# EAGLE schematic basic-maschinen (EAGLE 6.6.0)
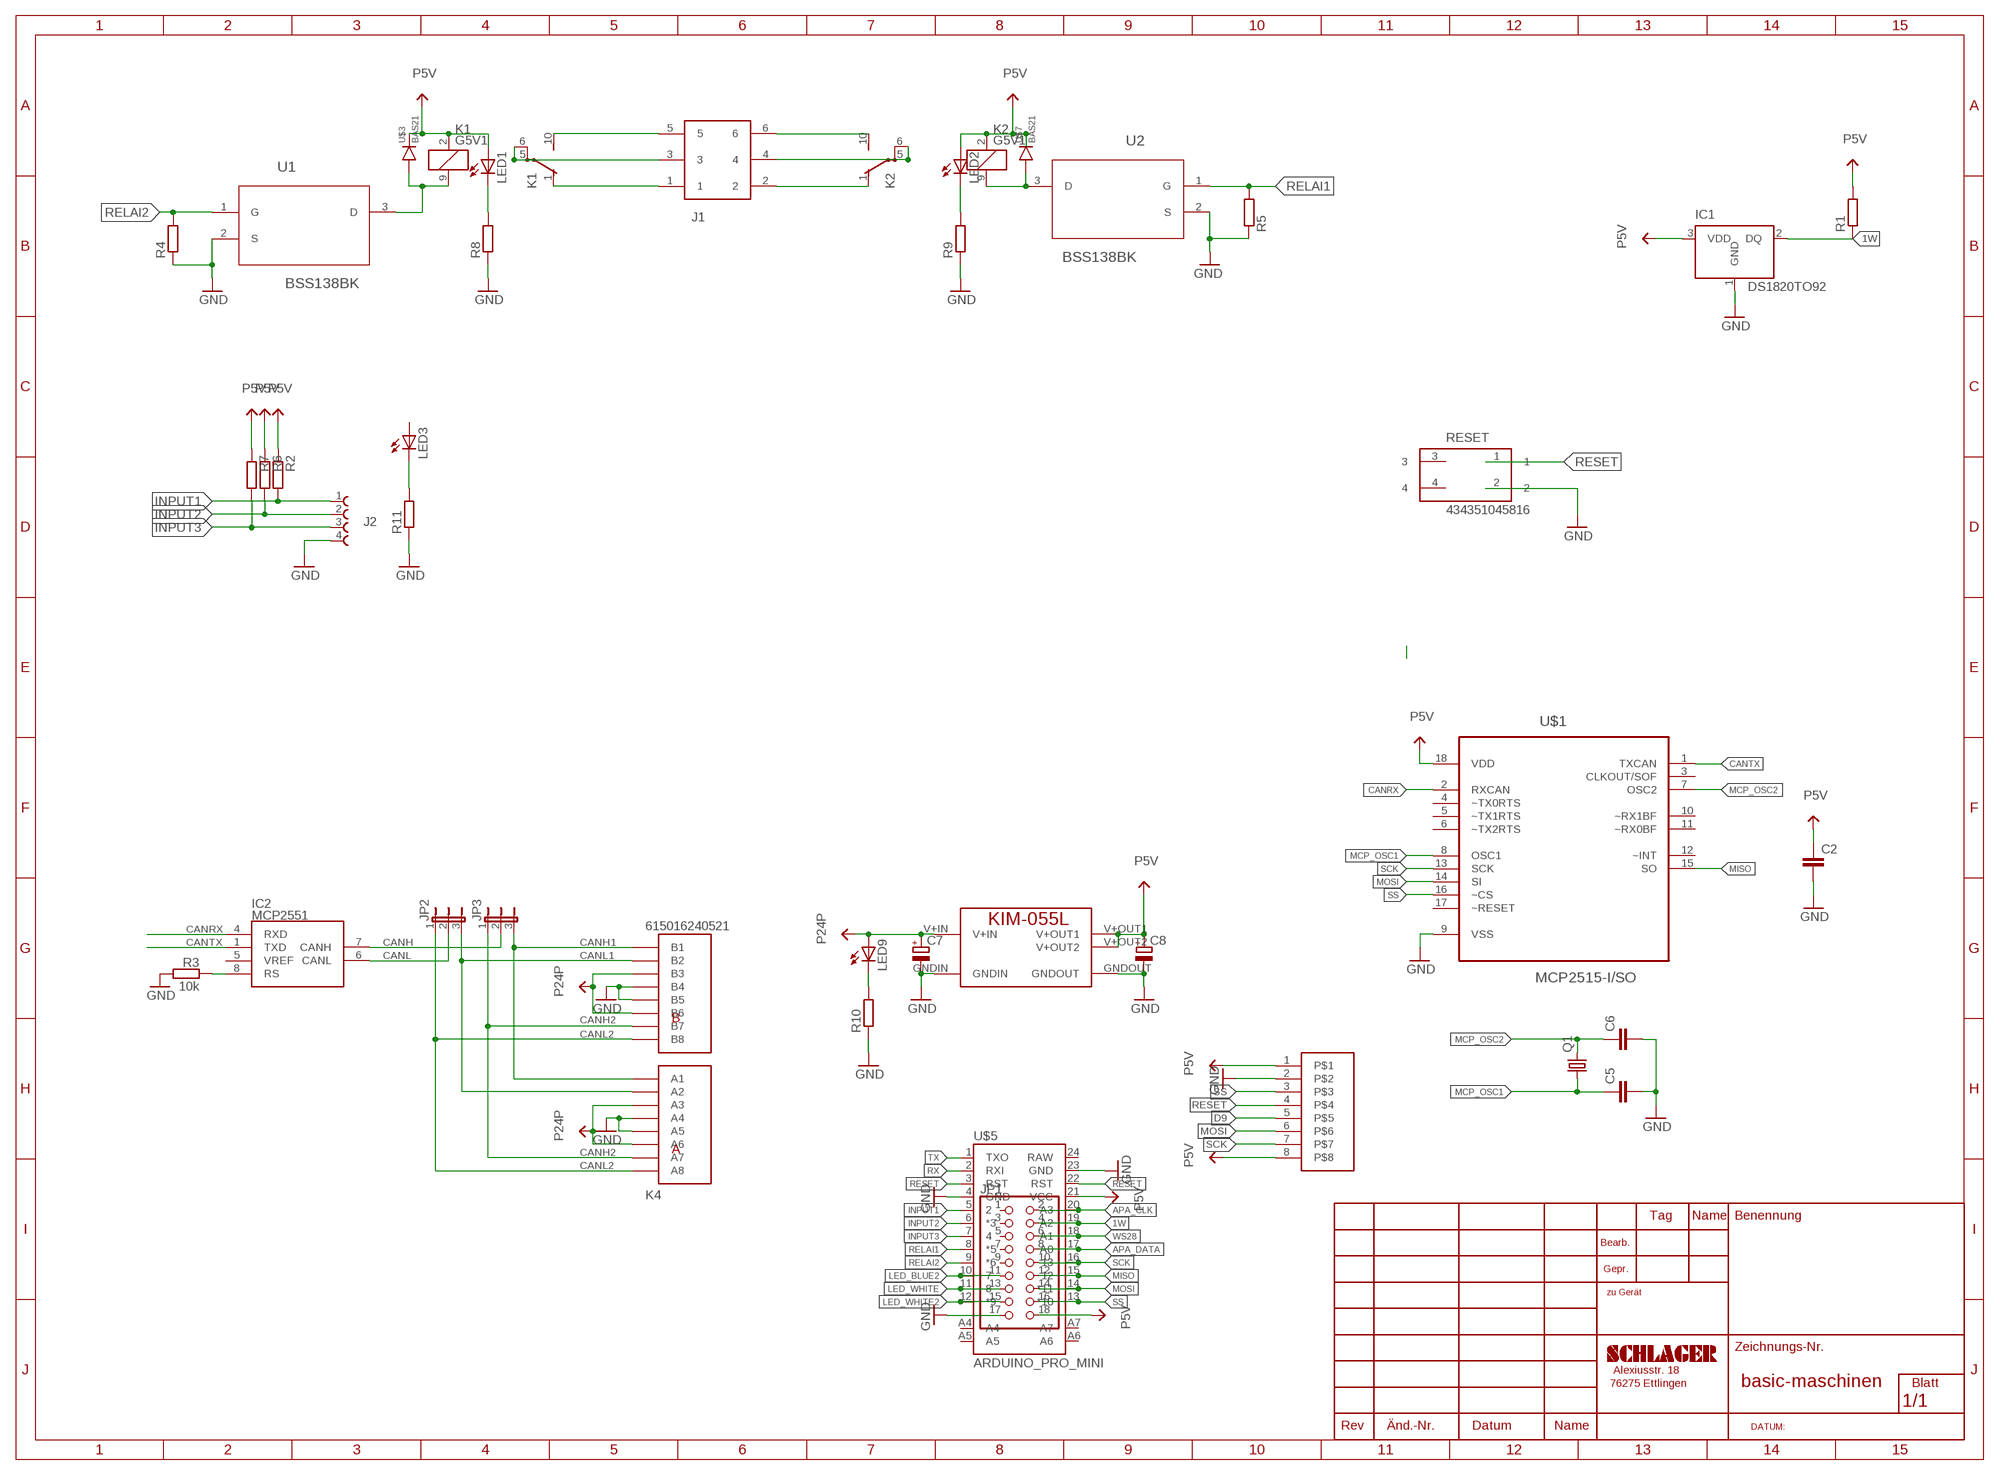
[diagram p0: schematic, sheet 1]

## Parts
C2  C-EUC0805  [C0805]
C5  C-EUC0805  [C0805]
C6  C-EUC0805  [C0805]
C7  CPOL-EUE5-10.5  [E5-10,5]
C8  CPOL-EUE5-10.5  [E5-10,5]
IC1  DS1820TO92  [TO-92]
IC2  MCP2551  [SO-8]
J1  691327310006  [691327310006]
J2  691322310004  [691322310004]
JP1  PINHD-2X9  [2X09]
JP2  JP2E  [JP2]
JP3  JP2E  [JP2]
K1  G5V1  [G5V1]
K2  G5V1  [G5V1]
K4  615016240521  [615016240521]
LED1  LED3MM  [LED3MM]
LED2  LED3MM  [LED3MM]
LED3  LED3MM  [LED3MM]
LED9  LED3MM  [LED3MM]
MOD1  KIM-055L  [KIM-055L]
Q1  CRYSTALHC49S  [HC49/S]
R1  R-EU_M0805  [M0805]
R2  R-EU_M0805  [M0805]
R3  10k  R-EU_R0603  [R0603]
R4  R-EU_M0805  [M0805]
R5  R-EU_M0805  [M0805]
R6  R-EU_M0805  [M0805]
R7  R-EU_M0805  [M0805]
R8  R-EU_R0805  [R0805]
R9  R-EU_R0805  [R0805]
R10  R-EU_R0805  [R0805]
R11  R-EU_R0805  [R0805]
RESET  434351045816  [434351045816]
U1  BSS138BK  [SOT65P210X110-3N]
U2  BSS138BK  [SOT65P210X110-3N]
U$1  MCP2515-I/SO  [SOIC127P1034X264-18N]
U$3  BAS21  [SOT23]
U$4  1.44-128X128  [1.44-128X128]
U$5  ARDUINO_PRO_MINI  [ARDUINO_PRO_MINI]
U$7  BAS21  [SOT23]

## Nets
1W: IC1.2(DQ) JP1.4 R1.1 U$5.19(A2)
APA_CLK: JP1.2 U$5.20(A3)
APA_DATA: JP1.8 U$5.17(A0)
CANH: IC2.7(CANH) JP3.2
CANH1: JP3.3 K4.A1 K4.B1
CANH2: JP3.1 K4.A7 K4.B7
CANL: IC2.6(CANL) JP2.2
CANL1: JP2.3 K4.A2 K4.B2
CANL2: JP2.1 K4.A8 K4.B8
CANRX: IC2.4(RXD) U$1.2(RXCAN)
CANTX: IC2.1(TXD) U$1.1(TXCAN)
D9: U$4.5
GND: C2.2 C5.2 C6.2 C7.- C8.- IC1.1(GND) J2.4 JP1.17 K4.A4 K4.A5 K4.B4 K4.B5 MOD1.GNDIN MOD1.GNDOUT R3.2 R4.1 R5.1 R8.1 R9.1 R10.1 R11.1 RESET.2 U1.2(S) U2.2(S) U$1.9(VSS) U$4.2 U$5.4(GND) U$5.23(GND)
INPUT1: J2.1 R2.2 U$5.5
INPUT2: J2.2 R6.2 U$5.6(*3)
INPUT3: J2.3 R7.2 U$5.7
LED_BLUE2: JP1.11 U$5.10
LED_WHITE: JP1.13 U$5.11
LED_WHITE2: JP1.15 U$5.12(*9)
MCP_OSC1: C5.1 Q1.1 U$1.8(OSC1)
MCP_OSC2: C6.1 Q1.2 U$1.7(OSC2)
MISO: JP1.12 U$1.15(SO) U$5.15
MOSI: JP1.14 U$1.14(SI) U$4.6 U$5.14(*11)
N$1: J1.6 K2.10(2:S)
N$2: J1.2 K2.1(2:O)
N$3: J1.4 K2.5(2:P) K2.6(2:P)
N$4: J1.3 K1.5(2:P) K1.6(2:P)
N$5: J1.5 K1.10(2:S)
N$6: J1.1 K1.1(2:O)
N$7: IC2.8(RS) R3.1
N$8: K1.9 U1.3(D) U$3.1(A)
N$9: LED9.K(C) R10.2
N$10: LED1.K(C) R8.2
N$11: LED2.K(C) R9.2
N$12: K2.9 U2.3(D) U$7.1(A)
N$14: LED3.K(C) R11.2
P5V: C2.1 C8.+ IC1.3(VDD) JP1.18 K1.2 K2.2 LED1.A LED2.A MOD1.V+OUT1 MOD1.V+OUT2 R1.2 R2.1 R6.1 R7.1 U$1.18(VDD) U$3.3(C) U$4.1 U$4.8 U$5.21(VCC) U$7.3(C)
P24P: C7.+ K4.A3 K4.A6 K4.B3 K4.B6 LED9.A MOD1.V+IN
RELAI1: R5.2 U2.1(G) U$5.8(*5)
RELAI2: R4.2 U1.1(G) U$5.9(*6)
RESET: RESET.1 U$4.4 U$5.3(RST) U$5.22(RST)
RX: U$5.2(RXI)
SCK: JP1.10 U$1.13(SCK) U$4.7 U$5.16
SS: JP1.16 U$1.16(~CS) U$4.3 U$5.13(*10)
TX: U$5.1(TXO)
WS28: JP1.6 U$5.18(A1)
Unconnected: IC2.2(GND) IC2.3(VCC) IC2.5(VREF) JP1.1 JP1.3 JP1.5 JP1.7 JP1.9 LED3.A RESET.3 RESET.4 U$1.3(CLKOUT/SOF) U$1.4(~TX0RTS) U$1.5(~TX1RTS) U$1.6(~TX2RTS) U$1.10(~RX1BF) U$1.11(~RX0BF) U$1.12(~INT) U$1.17(~RESET) U$5.24(RAW) U$5.A4 U$5.A5 U$5.A6 U$5.A7

## Library data of the parts
C2 C5 C6 = schlager_passiv:C-EU: CAPACITOR, European symbol
C7 C8 = schlager_passiv:CPOL-EU: POLARIZED CAPACITOR, European symbol
IC1 = schlager_ics:DS1820: DS1820 - 1-Wire Digital Thermometer
IC2 = MYMCHIP:MCP2551: CAN Transceiver
J1 = Eagle_TERMINAL_BLOCKS_rev16a:691327310006: WR-TBL Serie 3273 – 3.81mm Close Horizontal Dual Row PCB Header, 6 Pins=>Code : Con_TBL_Pluggable_3.81_PCB_THT_Double_691327310006 <http://katalog.we-online.de/media/images/eican/Con_TBL_Pluggable_3.81_PCB_THT_Double_6913273100xx_pf2.jpg> Details see: http://katalog.we-online.de/en/em/691_327_310_0xx Created 2014-06-19, Karrer Zheng 2014 (C) Würth Elektronik
J2 = Eagle_TERMINAL_BLOCKS_rev16a:691322310004: WR-TBL Serie 322 - 3.81mm Vertical PCB Header , 4 Pins=>Code : Con_TBL_Pluggable_3.81_PCB_THT_Simple_691322310004 <http://katalog.we-online.de/media/images/eican/Con_TBL_Pluggable_3.81_PCB_THT_Simple_6913223100xx_pf2.jpg> Details see: http://katalog.we-online.de/en/em/691_322_310_0xx Created 2014-06-19, Karrer Zheng 2014 (C) Würth Elektronik
JP1 = pinhead:PINHD-2X9: PIN HEADER
JP2 JP3 = jumper:JP2E: JUMPER
K1 K2 = relay:G5V1: RELAY 1 x switch, 0.5 A/125 V AC, 1 A/24 V DC , Omron; MPN: G5V-1-DC24; OC_FARNELL: 9949593; OC_NEWARK: 36M6377
K4 = Wuerth_Elektronik_eiCan_Communication_Connectors:615016240521: WR-MJ Horizontal Shielded Dual Stacked Port with EMI Panel Finger 8P8C Modular Jack Tab Up & Down, 16 Pins
LED1-LED3 LED9 = led:LED: LED OSRAM: - CHIPLED LG R971, LG N971, LY N971, LG Q971, LY Q971, LO R971, LY R971 LH N974, LH R974 LS Q976, LO Q976, LY Q976 LO Q996 - Hyper CHIPLED LW Q18S LB Q993, LB Q99A, LB R99A - SideLED LS A670, LO A670, LY A670, LG A670, LP A670 LB A673, LV A673, LT A673, LW A673 LH A674 LY A675 LS A676, LA A676, LO A676, LY A676, LW A676 LS A679, LY A679, LG A679 - Hyper Micro SIDELED® LS Y876, LA Y876, LO Y876, LY Y876 LT Y87S - SmartLED LW L88C, LW L88S LB L89C, LB L89S, LG L890 LS L89K, LO L89K, LY L89K LS L896, LA L896, LO L896, LY L896 - TOPLED LS T670, LO T670, LY T670, LG T670, LP T670 LSG T670, LSP T670, LSY T670, LOP T670, LYG T670 LG T671, LOG T671, LSG T671 LB T673, LV T673, LT T673, LW T673 LH T674 LS T676, LA T676, LO T676, LY T676, LB T676, LH T676, LSB T676, LW T676 LB T67C, LV T67C, LT T67C, LS T67K, LO T67K, LY T67K, LW E67C LS E67B, LA E67B, LO E67B, LY E67B, LB E67C, LV E67C, LT E67C LW T67C LS T679, LY T679, LG T679 LS T770, LO T770, LY T770, LG T770, LP T770 LB T773, LV T773, LT T773, LW T773 LH T774 LS E675, LA E675, LY E675, LS T675 LS T776, LA T776, LO T776, LY T776, LB T776 LHGB T686 LT T68C, LB T68C - Hyper Mini TOPLED® LB M676 - Mini TOPLED Santana® LG M470 LS M47K, LO M47K, LY M47K Source: http://www.osram.convergy.de LUXEON: - LUMILED® LXK2-PW12-R00, LXK2-PW12-S00, LXK2-PW14-U00, LXK2-PW14-V00 LXK2-PM12-R00, LXK2-PM12-S00, LXK2-PM14-U00 LXK2-PE12-Q00, LXK2-PE12-R00, LXK2-PE12-S00, LXK2-PE14-T00, LXK2-PE14-U00 LXK2-PB12-K00, LXK2-PB12-L00, LXK2-PB12-M00, LXK2-PB14-N00, LXK2-PB14-P00, LXK2-PB14-Q00 LXK2-PR12-L00, LXK2-PR12-M00, LXK2-PR14-Q00, LXK2-PR14-R00 LXK2-PD12-Q00, LXK2-PD12-R00, LXK2-PD12-S00 LXK2-PH12-R00, LXK2-PH12-S00 LXK2-PL12-P00, LXK2-PL12-Q00, LXK2-PL12-R00 Source: www.luxeon.com KINGBRIGHT: KA-3528ASYC Source: www.kingbright.com
MOD1 = kim055l:KIM-055L: 5V 5amp DC DC module. IMPORANT: Add low ESR input & output capacitors. V+OUT1 & V+OUT2 internally connected.
Q1 = crystal:CRYSTAL: CRYSTAL; OC_FARNELL: 1667008; OC_NEWARK: unknown
R1 R2 R4-R11 = schlager_passiv:R-EU_: RESISTOR, European symbol
R3 = rcl:R-EU_: RESISTOR, European symbol
RESET = Illuminated_Switches:434351045816: WS-TUS-3.5x4.7 mm side push SMD Tact Switch, 4 pins
U1 U2 = schlager_transistor:BSS138BK: N-channel Trench MOSFET; MPN: BSS138BK; OC_FARNELL: 2053833; OC_NEWARK: 61T7486; PACKAGE: SOT-23-3; SUPPLIER: NXP
U$1 = schlager_ics:MCP2515-I/SO: CAN Controller; MPN: MCP2515-I/SO; OC_FARNELL: 1292239; OC_NEWARK: 29H7136; PACKAGE: SOIC-18; SUPPLIER: Microchip
U$3 U$7 = schlager_dioden:BAS21; MPN: BAS21; OC_ELBE: 01.41.0043.0; OC_FARNELL: 8734267RL; SUPPLIER: NXP
U$4 = schlager_modules:1.44-128X128
U$5 = SparkFun-Boards:ARDUINO_PRO_MINI

## Net classes
4 USBpair: width 0.254 mm, drill 0.406 mm, clearance 0.508 mm